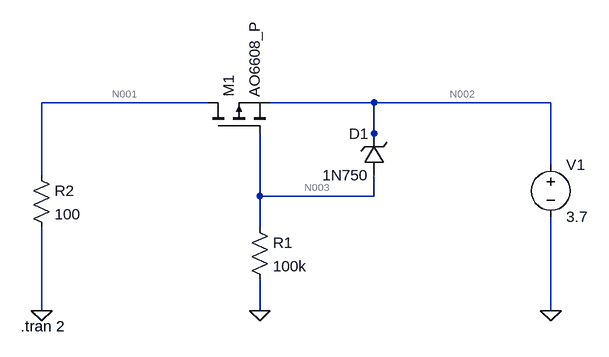
[diagram p0: schematic Draft3.asc]
Draft3.asc, the LTspice schematic file:
Version 4.1
SHEET 1 1028 680
WIRE 144 112 -112 112
WIRE 400 112 240 112
WIRE 672 112 400 112
WIRE 400 160 400 112
WIRE 400 176 400 160
WIRE 672 208 672 112
WIRE -112 224 -112 112
WIRE 224 256 224 160
WIRE 400 256 400 224
WIRE 400 256 224 256
WIRE 224 304 224 256
WIRE -112 432 -112 304
WIRE 224 432 224 384
WIRE 672 432 672 288
FLAG 224 432 0
FLAG -112 432 0
FLAG 672 432 0
SYMBOL pmos 144 160 R270
SYMATTR InstName M1
SYMATTR Value AO6608_P
SYMBOL res 208 288 R0
SYMATTR InstName R1
SYMATTR Value 100k
SYMBOL voltage 672 192 R0
WINDOW 123 0 0 Left 0
WINDOW 39 0 0 Left 0
SYMATTR InstName V1
SYMATTR Value 3.7
SYMBOL zener 416 224 R180
WINDOW 0 24 64 Left 2
WINDOW 3 24 0 Left 2
SYMATTR InstName D1
SYMATTR Value 1N750
SYMBOL res -128 208 R0
SYMATTR InstName R2
SYMATTR Value 100
TEXT -144 456 Left 2 !.tran 2

The netlist it stands for:
* Draft3.asc
M1 N001 N003 N002 N002 AO6608_P
R1 N003 0 100k
V1 N002 0 3.7
D1 N003 N002 1N750
R2 N001 0 100
.model D D
.lib standard.dio
.model NMOS NMOS
.model PMOS PMOS
.lib standard.mos
.tran 2
.backanno
.end

* Results of the author's LTspice run, read from the files saved beside the schematic
* Operating Point, zero values left out:
*   V(n003) = 1.034 V
*   V(n001) = 3.697 V
*   V(n002) = 3.7 V
*   Id(M1) = -36.97 mA
*   Is(M1) = 36.97 mA
*   I(V1) = -36.98 mA
*   I(R2) = 36.97 mA
*   I(R1) = 10.34 µA
*   I(D1) = -10.34 µA